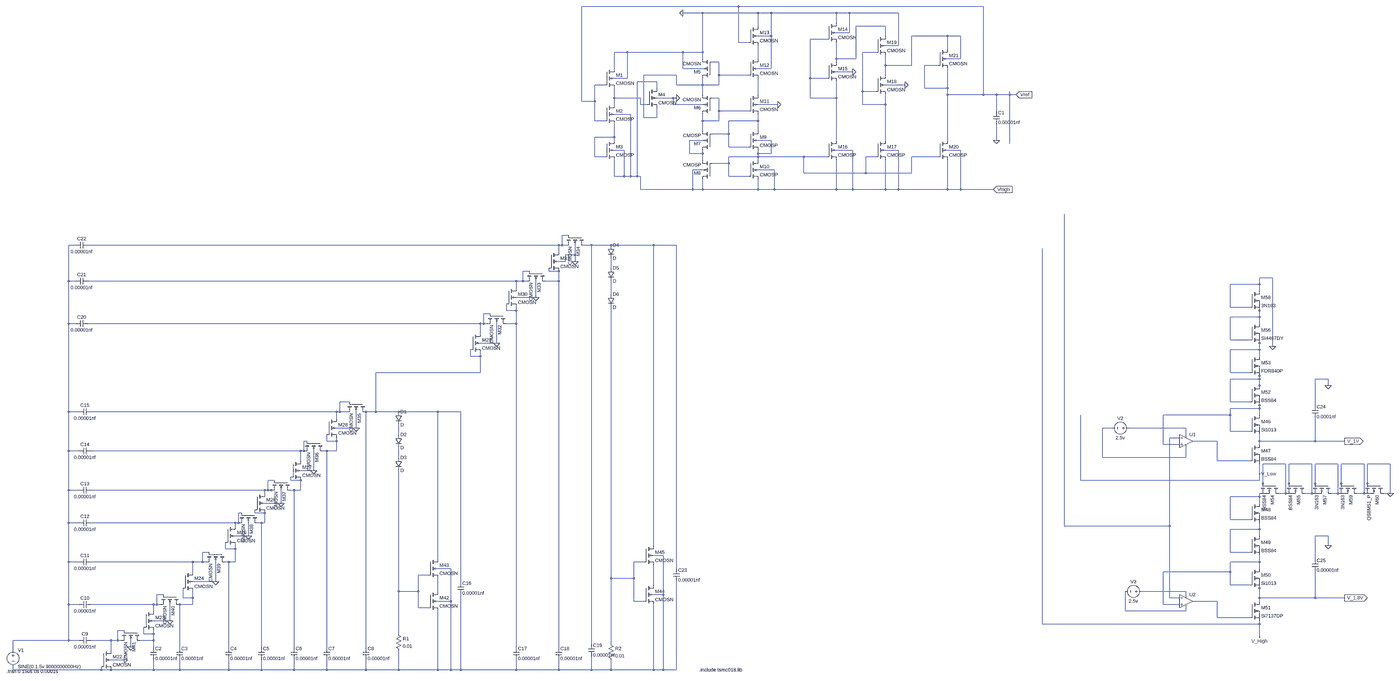
[diagram p0: schematic Vreference_regulator_rectifier.asc, whole sheet]
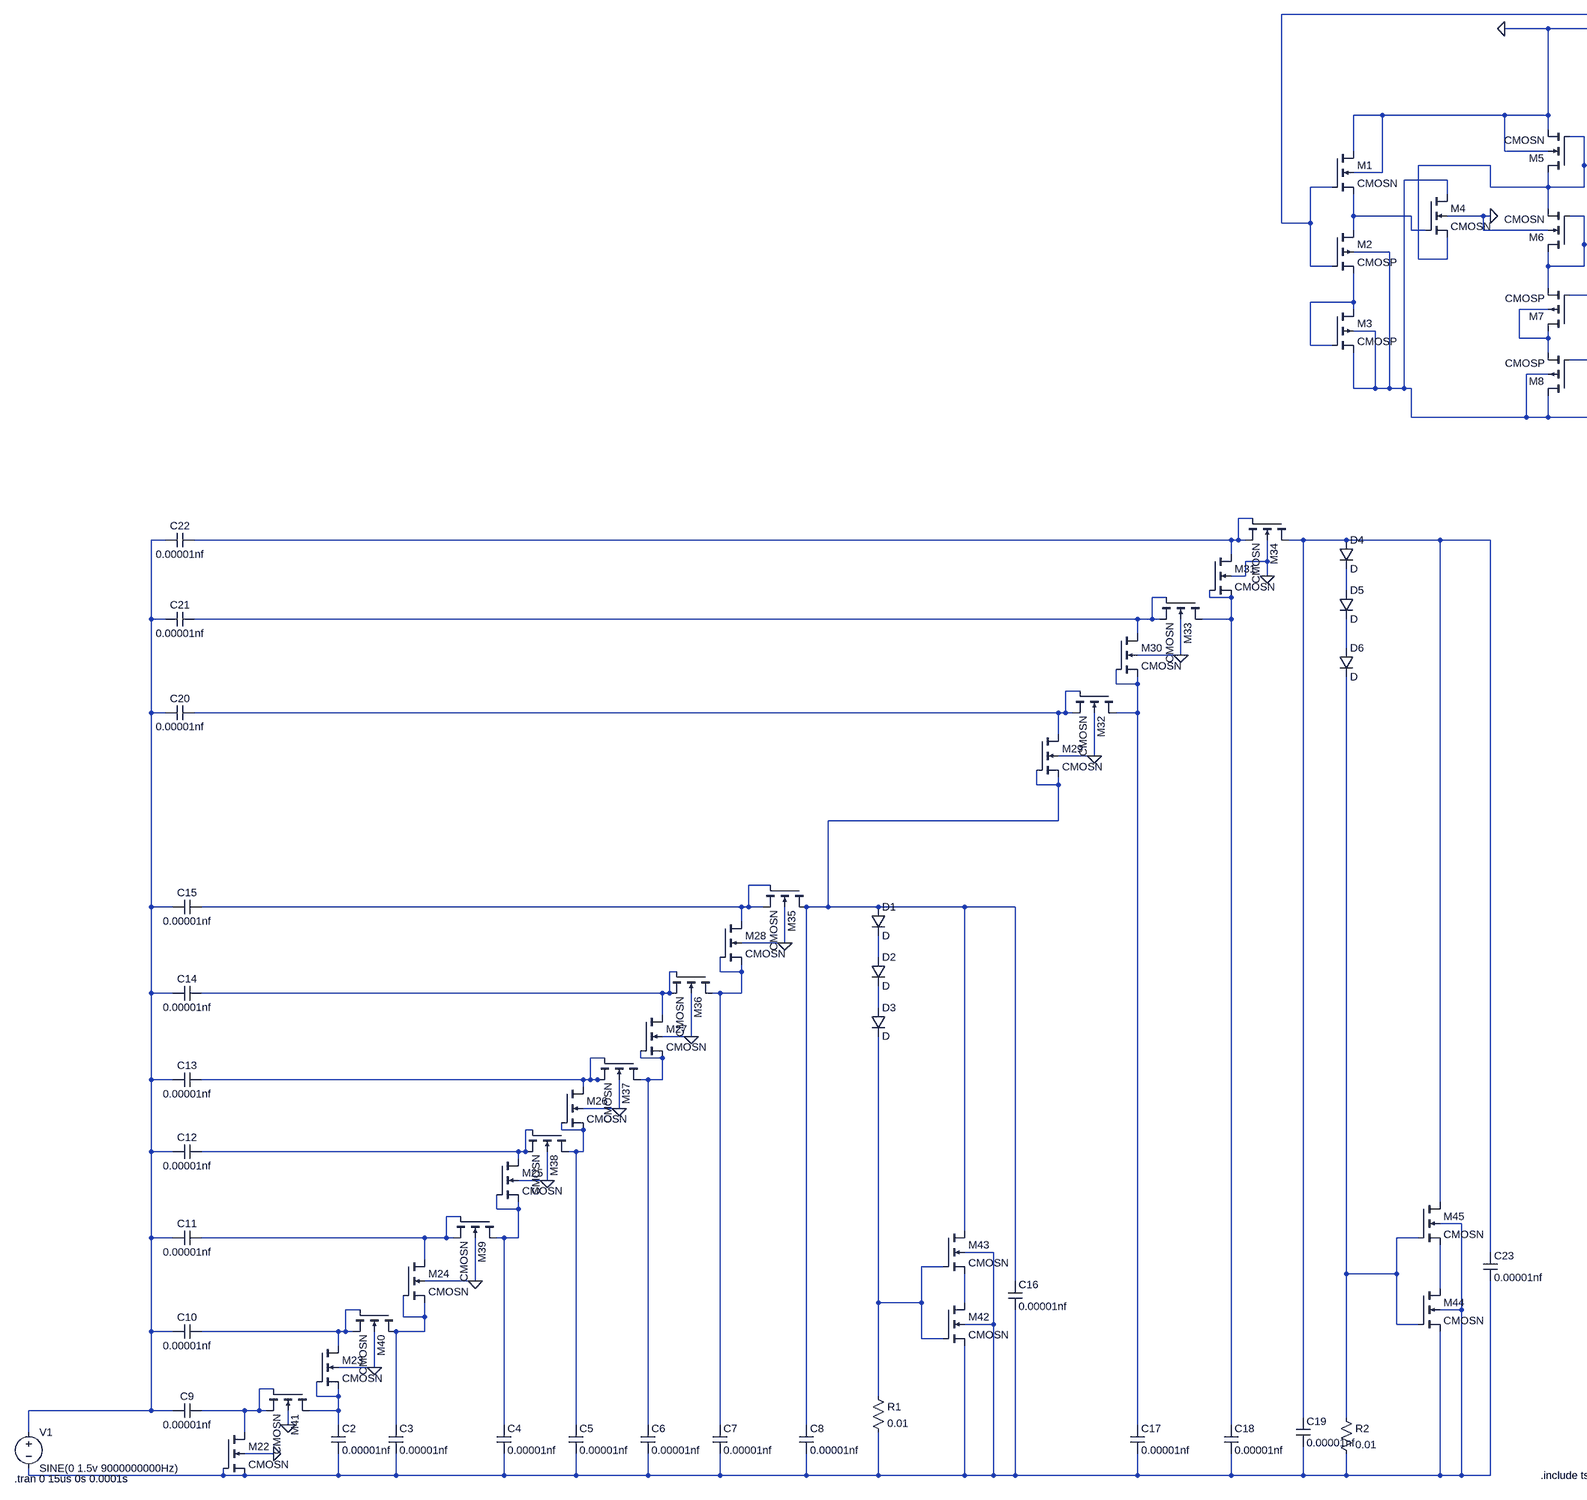
[diagram p1: schematic Vreference_regulator_rectifier.asc, part, row 1 of 1, column 1 of 2]
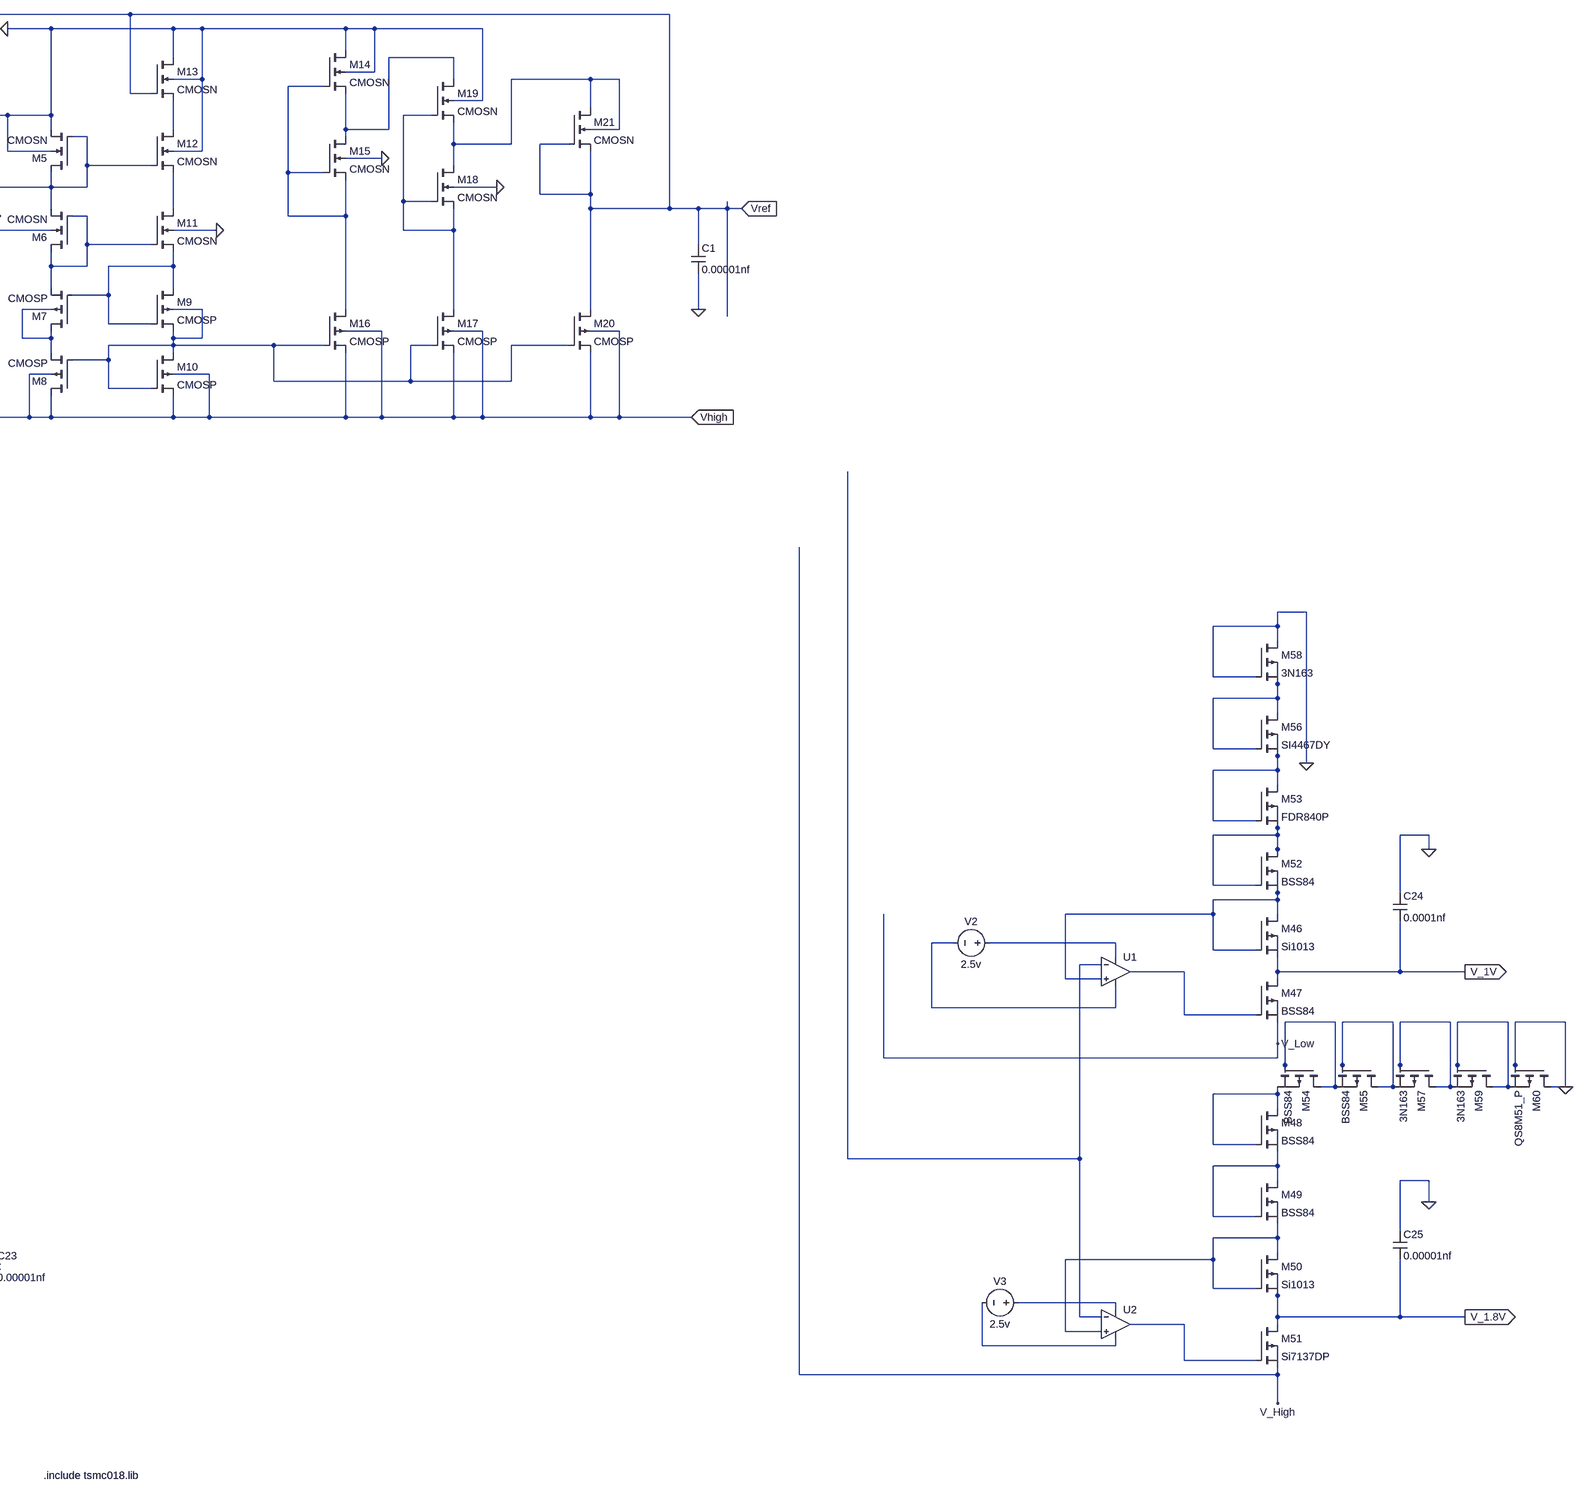
[diagram p2: schematic Vreference_regulator_rectifier.asc, part, row 1 of 1, column 2 of 2]
Vreference_regulator_rectifier.asc, the LTspice schematic file:
Version 4
SHEET 1 4676 1368
WIRE -880 -5136 -1648 -5136
WIRE 336 -5136 -880 -5136
WIRE -1056 -5104 -1152 -5104
WIRE -784 -5104 -1056 -5104
WIRE -720 -5104 -784 -5104
WIRE -384 -5104 -720 -5104
WIRE -320 -5104 -384 -5104
WIRE -80 -5104 -320 -5104
WIRE -384 -5056 -384 -5104
WIRE -784 -5040 -784 -5104
WIRE -144 -5040 -288 -5040
WIRE -320 -5008 -320 -5104
WIRE -320 -5008 -384 -5008
WIRE -720 -4992 -720 -5104
WIRE -720 -4992 -784 -4992
WIRE -144 -4992 -144 -5040
WIRE 160 -4992 -16 -4992
WIRE 224 -4992 160 -4992
WIRE -432 -4976 -512 -4976
WIRE -880 -4960 -880 -5136
WIRE -832 -4960 -880 -4960
WIRE -80 -4944 -80 -5104
WIRE -80 -4944 -144 -4944
WIRE 160 -4928 160 -4992
WIRE -1424 -4912 -1488 -4912
WIRE -1152 -4912 -1424 -4912
WIRE -1056 -4912 -1056 -5104
WIRE -1056 -4912 -1152 -4912
WIRE -192 -4912 -256 -4912
WIRE -1056 -4880 -1056 -4912
WIRE -784 -4880 -784 -4944
WIRE -384 -4880 -384 -4960
WIRE -288 -4880 -288 -5040
WIRE -288 -4880 -384 -4880
WIRE 224 -4880 224 -4992
WIRE 224 -4880 160 -4880
WIRE -976 -4864 -1008 -4864
WIRE -384 -4864 -384 -4880
WIRE -144 -4848 -144 -4896
WIRE -16 -4848 -16 -4992
WIRE -16 -4848 -144 -4848
WIRE 112 -4848 48 -4848
WIRE -1488 -4832 -1488 -4912
WIRE -1152 -4832 -1152 -4912
WIRE -1056 -4832 -1152 -4832
WIRE -720 -4832 -720 -4992
WIRE -720 -4832 -784 -4832
WIRE -304 -4816 -384 -4816
WIRE -1184 -4800 -1344 -4800
WIRE -976 -4800 -976 -4864
WIRE -832 -4800 -976 -4800
WIRE -144 -4800 -144 -4848
WIRE -1424 -4784 -1424 -4912
WIRE -1424 -4784 -1488 -4784
WIRE -512 -4784 -512 -4976
WIRE -432 -4784 -512 -4784
WIRE -1280 -4768 -1376 -4768
WIRE -1536 -4752 -1584 -4752
WIRE -1184 -4752 -1184 -4800
WIRE -1056 -4752 -1056 -4784
WIRE -1056 -4752 -1184 -4752
WIRE -976 -4752 -976 -4800
WIRE -976 -4752 -1056 -4752
WIRE -48 -4752 -144 -4752
WIRE -1280 -4736 -1280 -4768
WIRE 48 -4736 48 -4848
WIRE 160 -4736 160 -4832
WIRE 160 -4736 48 -4736
WIRE -256 -4720 -256 -4912
WIRE -192 -4720 -256 -4720
WIRE -1056 -4704 -1056 -4752
WIRE -784 -4704 -784 -4784
WIRE 160 -4704 160 -4736
WIRE 336 -4704 336 -5136
WIRE 336 -4704 160 -4704
WIRE 400 -4704 336 -4704
WIRE 464 -4704 464 -4720
WIRE 464 -4704 400 -4704
WIRE 496 -4704 464 -4704
WIRE -1488 -4688 -1488 -4736
WIRE -1360 -4688 -1488 -4688
WIRE -1200 -4688 -1280 -4688
WIRE -1184 -4688 -1200 -4688
WIRE -976 -4688 -1008 -4688
WIRE -512 -4688 -512 -4784
WIRE -384 -4688 -384 -4768
WIRE -384 -4688 -512 -4688
WIRE -1648 -4672 -1648 -5136
WIRE -1584 -4672 -1584 -4752
WIRE -1584 -4672 -1648 -4672
WIRE -1488 -4656 -1488 -4688
WIRE -1360 -4656 -1360 -4688
WIRE -1328 -4656 -1360 -4656
WIRE -1200 -4656 -1200 -4688
WIRE -1056 -4656 -1200 -4656
WIRE -688 -4656 -784 -4656
WIRE -256 -4656 -256 -4720
WIRE -144 -4656 -144 -4704
WIRE -144 -4656 -256 -4656
WIRE -976 -4624 -976 -4688
WIRE -832 -4624 -976 -4624
WIRE 400 -4624 400 -4704
WIRE -1408 -4608 -1488 -4608
WIRE -1344 -4592 -1344 -4800
WIRE -1280 -4592 -1280 -4640
WIRE -1280 -4592 -1344 -4592
WIRE -1584 -4576 -1584 -4672
WIRE -1536 -4576 -1584 -4576
WIRE -1056 -4576 -1056 -4608
WIRE -976 -4576 -976 -4624
WIRE -976 -4576 -1056 -4576
WIRE -784 -4576 -784 -4608
WIRE -784 -4576 -928 -4576
WIRE -1056 -4528 -1056 -4576
WIRE -784 -4528 -784 -4576
WIRE -928 -4512 -928 -4576
WIRE -928 -4512 -1008 -4512
WIRE -1488 -4496 -1488 -4560
WIRE -1488 -4496 -1584 -4496
WIRE -1488 -4480 -1488 -4496
WIRE -1056 -4480 -1120 -4480
WIRE -720 -4480 -784 -4480
WIRE -384 -4480 -384 -4688
WIRE -144 -4480 -144 -4656
WIRE 160 -4480 160 -4704
WIRE 400 -4480 400 -4560
WIRE 464 -4464 464 -4704
WIRE -928 -4448 -928 -4512
WIRE -832 -4448 -928 -4448
WIRE -1440 -4432 -1488 -4432
WIRE -304 -4432 -384 -4432
WIRE -80 -4432 -144 -4432
WIRE 224 -4432 160 -4432
WIRE -1120 -4416 -1120 -4480
WIRE -1056 -4416 -1056 -4432
WIRE -1056 -4416 -1120 -4416
WIRE -784 -4416 -784 -4432
WIRE -720 -4416 -720 -4480
WIRE -720 -4416 -784 -4416
WIRE -1584 -4400 -1584 -4496
WIRE -1536 -4400 -1584 -4400
WIRE -784 -4400 -784 -4416
WIRE -784 -4400 -928 -4400
WIRE -544 -4400 -784 -4400
WIRE -432 -4400 -544 -4400
WIRE -192 -4400 -240 -4400
WIRE 112 -4400 -16 -4400
WIRE -1056 -4384 -1056 -4416
WIRE -784 -4384 -784 -4400
WIRE -928 -4368 -928 -4400
WIRE -928 -4368 -1008 -4368
WIRE -1056 -4336 -1104 -4336
WIRE -704 -4336 -784 -4336
WIRE -544 -4320 -544 -4400
WIRE -240 -4320 -240 -4400
WIRE -240 -4320 -544 -4320
WIRE -16 -4320 -16 -4400
WIRE -16 -4320 -240 -4320
WIRE -1488 -4304 -1488 -4384
WIRE -1440 -4304 -1440 -4432
WIRE -1440 -4304 -1488 -4304
WIRE -1408 -4304 -1408 -4608
WIRE -1408 -4304 -1440 -4304
WIRE -1376 -4304 -1376 -4768
WIRE -1376 -4304 -1408 -4304
WIRE -1360 -4304 -1376 -4304
WIRE -928 -4304 -928 -4368
WIRE -832 -4304 -928 -4304
WIRE -1360 -4240 -1360 -4304
WIRE -1104 -4240 -1104 -4336
WIRE -1104 -4240 -1360 -4240
WIRE -1056 -4240 -1056 -4288
WIRE -1056 -4240 -1104 -4240
WIRE -784 -4240 -784 -4288
WIRE -784 -4240 -1056 -4240
WIRE -704 -4240 -704 -4336
WIRE -704 -4240 -784 -4240
WIRE -384 -4240 -384 -4384
WIRE -384 -4240 -704 -4240
WIRE -304 -4240 -304 -4432
WIRE -304 -4240 -384 -4240
WIRE -144 -4240 -144 -4384
WIRE -144 -4240 -304 -4240
WIRE -80 -4240 -80 -4432
WIRE -80 -4240 -144 -4240
WIRE 160 -4240 160 -4384
WIRE 160 -4240 -80 -4240
WIRE 224 -4240 224 -4432
WIRE 224 -4240 160 -4240
WIRE 384 -4240 224 -4240
WIRE -1712 -3120 -1744 -3120
WIRE -4128 -3072 -4160 -3072
WIRE -1760 -3072 -4064 -3072
WIRE -1744 -3072 -1744 -3120
WIRE -1744 -3072 -1760 -3072
WIRE -1728 -3072 -1744 -3072
WIRE -1600 -3072 -1632 -3072
WIRE -1504 -3072 -1600 -3072
WIRE -1296 -3072 -1504 -3072
WIRE -1184 -3072 -1296 -3072
WIRE -1760 -3040 -1760 -3072
WIRE -1680 -3024 -1680 -3072
WIRE -1680 -3024 -1728 -3024
WIRE -1728 -2992 -1728 -3024
WIRE -1728 -2992 -1760 -2992
WIRE -1680 -2992 -1680 -3024
WIRE -1504 -2960 -1504 -3008
WIRE -1904 -2944 -1936 -2944
WIRE -1808 -2944 -1808 -2960
WIRE -1760 -2944 -1808 -2944
WIRE 2112 -2912 2048 -2912
WIRE -4160 -2896 -4160 -3072
WIRE -4128 -2896 -4160 -2896
WIRE -1968 -2896 -4064 -2896
WIRE -1936 -2896 -1936 -2944
WIRE -1936 -2896 -1968 -2896
WIRE -1920 -2896 -1936 -2896
WIRE -1760 -2896 -1760 -2944
WIRE -1760 -2896 -1824 -2896
WIRE 2048 -2880 2048 -2912
WIRE 2048 -2880 1904 -2880
WIRE -1968 -2864 -1968 -2896
WIRE 2048 -2848 2048 -2880
WIRE -1504 -2832 -1504 -2896
WIRE -1872 -2816 -1872 -2896
WIRE -1872 -2816 -1968 -2816
WIRE 1904 -2768 1904 -2880
WIRE 2000 -2768 1904 -2768
WIRE -2016 -2752 -2016 -2784
WIRE -1968 -2752 -1968 -2768
WIRE -1968 -2752 -2016 -2752
WIRE 2048 -2752 2048 -2768
WIRE -2096 -2736 -2128 -2736
WIRE 2048 -2720 2048 -2752
WIRE 2048 -2720 1904 -2720
WIRE -4160 -2688 -4160 -2896
WIRE -4128 -2688 -4160 -2688
WIRE -2144 -2688 -4064 -2688
WIRE -2128 -2688 -2128 -2736
WIRE -2128 -2688 -2144 -2688
WIRE -2112 -2688 -2128 -2688
WIRE -1968 -2688 -1968 -2752
WIRE -1968 -2688 -2016 -2688
WIRE 2048 -2688 2048 -2720
WIRE -2144 -2640 -2144 -2688
WIRE 1904 -2608 1904 -2720
WIRE 2000 -2608 1904 -2608
WIRE -2064 -2592 -2064 -2688
WIRE -2064 -2592 -2144 -2592
WIRE 2048 -2592 2048 -2608
WIRE 2112 -2576 2112 -2912
WIRE 2048 -2560 2048 -2592
WIRE 2048 -2560 1904 -2560
WIRE -2192 -2528 -2192 -2560
WIRE -2144 -2528 -2144 -2544
WIRE -2144 -2528 -2192 -2528
WIRE 2048 -2528 2048 -2560
WIRE -2144 -2448 -2144 -2528
WIRE -2144 -2448 -2656 -2448
WIRE 1904 -2448 1904 -2560
WIRE 2000 -2448 1904 -2448
WIRE 2048 -2432 2048 -2448
WIRE 2048 -2416 2048 -2432
WIRE 2048 -2416 1904 -2416
WIRE 2384 -2416 2320 -2416
WIRE 2048 -2384 2048 -2416
WIRE 2384 -2384 2384 -2416
WIRE 2048 -2368 2048 -2384
WIRE -2784 -2304 -2832 -2304
WIRE 1904 -2304 1904 -2416
WIRE 2000 -2304 1904 -2304
WIRE 2048 -2288 2048 -2304
WIRE 2320 -2288 2320 -2416
WIRE 2048 -2272 2048 -2288
WIRE 2048 -2272 1904 -2272
WIRE -4160 -2256 -4160 -2688
WIRE -4112 -2256 -4160 -2256
WIRE -2848 -2256 -4048 -2256
WIRE -2832 -2256 -2832 -2304
WIRE -2832 -2256 -2848 -2256
WIRE -2800 -2256 -2832 -2256
WIRE -2656 -2256 -2656 -2448
WIRE -2656 -2256 -2704 -2256
WIRE -2544 -2256 -2656 -2256
WIRE -2352 -2256 -2544 -2256
WIRE -2240 -2256 -2352 -2256
WIRE 1904 -2240 1904 -2272
WIRE 1904 -2240 1536 -2240
WIRE 2048 -2240 2048 -2272
WIRE -2848 -2224 -2848 -2256
WIRE -2752 -2176 -2752 -2256
WIRE -2752 -2176 -2848 -2176
WIRE 1280 -2176 1232 -2176
WIRE 1648 -2176 1360 -2176
WIRE 1904 -2160 1904 -2240
WIRE 2000 -2160 1904 -2160
WIRE -2544 -2144 -2544 -2192
WIRE 1648 -2144 1648 -2176
WIRE 1616 -2128 1568 -2128
WIRE -2992 -2112 -3008 -2112
WIRE -2896 -2112 -2896 -2144
WIRE -2848 -2112 -2848 -2128
WIRE -2848 -2112 -2896 -2112
WIRE 1840 -2112 1680 -2112
WIRE 2048 -2112 2048 -2144
WIRE 2320 -2112 2320 -2224
WIRE 2320 -2112 2048 -2112
WIRE 2464 -2112 2320 -2112
WIRE 1536 -2096 1536 -2240
WIRE 1616 -2096 1536 -2096
WIRE 2048 -2096 2048 -2112
WIRE -4160 -2064 -4160 -2256
WIRE -4112 -2064 -4160 -2064
WIRE -3024 -2064 -4048 -2064
WIRE -3008 -2064 -3008 -2112
WIRE -3008 -2064 -3024 -2064
WIRE -2896 -2064 -2912 -2064
WIRE -2848 -2064 -2848 -2112
WIRE -2848 -2064 -2896 -2064
WIRE -2544 -2032 -2544 -2080
WIRE 1232 -2032 1232 -2176
WIRE 1648 -2032 1648 -2080
WIRE 1648 -2032 1232 -2032
WIRE -3024 -2016 -3024 -2064
WIRE 1840 -2016 1840 -2112
WIRE 2000 -2016 1840 -2016
WIRE 2176 -2000 2064 -2000
WIRE 2304 -2000 2192 -2000
WIRE 2432 -2000 2320 -2000
WIRE 2560 -2000 2448 -2000
WIRE 2688 -2000 2576 -2000
WIRE -2960 -1968 -2960 -2064
WIRE -2960 -1968 -3024 -1968
WIRE 2048 -1952 2048 -2000
WIRE -3152 -1920 -3184 -1920
WIRE -3072 -1920 -3072 -1936
WIRE -3024 -1920 -3072 -1920
WIRE 960 -1920 960 -2240
WIRE 2048 -1920 2048 -1952
WIRE 2048 -1920 960 -1920
WIRE 2064 -1904 2064 -2000
WIRE 2192 -1904 2192 -2000
WIRE 2320 -1904 2320 -2000
WIRE 2448 -1904 2448 -2000
WIRE 2576 -1904 2576 -2000
WIRE 2064 -1888 2064 -1904
WIRE 2192 -1888 2192 -1904
WIRE 2320 -1888 2320 -1904
WIRE 2448 -1888 2448 -1904
WIRE 2576 -1888 2576 -1904
WIRE -4160 -1872 -4160 -2064
WIRE -4112 -1872 -4160 -1872
WIRE -3200 -1872 -4048 -1872
WIRE -3184 -1872 -3184 -1920
WIRE -3184 -1872 -3200 -1872
WIRE -3168 -1872 -3184 -1872
WIRE -3152 -1872 -3168 -1872
WIRE -3056 -1872 -3072 -1872
WIRE -3024 -1872 -3024 -1920
WIRE -3024 -1872 -3056 -1872
WIRE -3200 -1856 -3200 -1872
WIRE 2176 -1856 2176 -2000
WIRE 2176 -1856 2144 -1856
WIRE 2304 -1856 2304 -2000
WIRE 2304 -1856 2272 -1856
WIRE 2432 -1856 2432 -2000
WIRE 2432 -1856 2400 -1856
WIRE 2560 -1856 2560 -2000
WIRE 2560 -1856 2528 -1856
WIRE 2688 -1856 2688 -2000
WIRE 2688 -1856 2656 -1856
WIRE 2048 -1840 2048 -1856
WIRE 2048 -1840 1904 -1840
WIRE -3120 -1808 -3120 -1872
WIRE -3120 -1808 -3200 -1808
WIRE 2048 -1808 2048 -1840
WIRE -3312 -1760 -3328 -1760
WIRE -3248 -1760 -3248 -1776
WIRE -3200 -1760 -3248 -1760
WIRE 1904 -1728 1904 -1840
WIRE 2000 -1728 1904 -1728
WIRE -4160 -1712 -4160 -1872
WIRE -4112 -1712 -4160 -1712
WIRE -3344 -1712 -4048 -1712
WIRE -3328 -1712 -3328 -1760
WIRE -3328 -1712 -3344 -1712
WIRE -3216 -1712 -3232 -1712
WIRE -3200 -1712 -3200 -1760
WIRE -3200 -1712 -3216 -1712
WIRE -3344 -1696 -3344 -1712
WIRE 880 -1696 880 -3488
WIRE 1568 -1696 1568 -2128
WIRE 1568 -1696 880 -1696
WIRE 2048 -1680 2048 -1712
WIRE 2048 -1680 1904 -1680
WIRE -3280 -1648 -3280 -1712
WIRE -3280 -1648 -3344 -1648
WIRE 2048 -1648 2048 -1680
WIRE 2384 -1648 2320 -1648
WIRE -1296 -1600 -1296 -3072
WIRE 2384 -1600 2384 -1648
WIRE -3392 -1584 -3392 -1616
WIRE -3344 -1584 -3344 -1600
WIRE -3344 -1584 -3392 -1584
WIRE -3472 -1568 -3504 -1568
WIRE 1904 -1568 1904 -1680
WIRE 2000 -1568 1904 -1568
WIRE -1248 -1552 -1296 -1552
WIRE -2352 -1536 -2352 -2256
WIRE 2320 -1536 2320 -1648
WIRE -4160 -1520 -4160 -1712
WIRE -4112 -1520 -4160 -1520
WIRE -3552 -1520 -4048 -1520
WIRE -3504 -1520 -3504 -1568
WIRE -3504 -1520 -3552 -1520
WIRE -3488 -1520 -3504 -1520
WIRE -3376 -1520 -3392 -1520
WIRE -3344 -1520 -3344 -1584
WIRE -3344 -1520 -3376 -1520
WIRE -1344 -1520 -1392 -1520
WIRE 2048 -1520 2048 -1552
WIRE 2048 -1520 1904 -1520
WIRE -2288 -1488 -2352 -1488
WIRE -1184 -1488 -1184 -3072
WIRE 2048 -1488 2048 -1520
WIRE -3552 -1472 -3552 -1520
WIRE 1904 -1472 1904 -1520
WIRE 1904 -1472 1536 -1472
WIRE -2400 -1456 -2448 -1456
WIRE -1504 -1440 -1504 -2768
WIRE -1392 -1440 -1392 -1520
WIRE -1392 -1440 -1504 -1440
WIRE -3440 -1424 -3440 -1520
WIRE -3440 -1424 -3552 -1424
WIRE -2240 -1424 -2240 -2256
WIRE -1296 -1408 -1296 -1504
WIRE 1904 -1408 1904 -1472
WIRE 2000 -1408 1904 -1408
WIRE 2048 -1392 2048 -1408
WIRE -2544 -1376 -2544 -1968
WIRE -2448 -1376 -2448 -1456
WIRE -2448 -1376 -2544 -1376
WIRE -2352 -1376 -2352 -1440
WIRE 1648 -1376 1424 -1376
WIRE -3696 -1360 -3728 -1360
WIRE -1248 -1360 -1248 -1552
WIRE -1248 -1360 -1296 -1360
WIRE 1648 -1360 1648 -1376
WIRE -3600 -1344 -3600 -1392
WIRE -3552 -1344 -3552 -1376
WIRE -3552 -1344 -3600 -1344
WIRE 1568 -1344 1568 -1696
WIRE 1616 -1344 1568 -1344
WIRE 2048 -1344 2048 -1392
WIRE 2320 -1344 2320 -1472
WIRE 2320 -1344 2048 -1344
WIRE 2464 -1344 2320 -1344
WIRE -2288 -1328 -2288 -1488
WIRE -2288 -1328 -2352 -1328
WIRE -1392 -1328 -1392 -1440
WIRE -1344 -1328 -1392 -1328
WIRE 1840 -1328 1680 -1328
WIRE 2048 -1328 2048 -1344
WIRE -4160 -1312 -4160 -1520
WIRE -4112 -1312 -4160 -1312
WIRE -3744 -1312 -4048 -1312
WIRE -3728 -1312 -3728 -1360
WIRE -3728 -1312 -3744 -1312
WIRE -3712 -1312 -3728 -1312
WIRE -3552 -1312 -3552 -1344
WIRE -3552 -1312 -3616 -1312
WIRE 1536 -1312 1536 -1472
WIRE 1616 -1312 1536 -1312
WIRE -2448 -1296 -2448 -1376
WIRE -2400 -1296 -2448 -1296
WIRE -3744 -1280 -3744 -1312
WIRE 1344 -1280 1344 -1376
WIRE 1648 -1280 1648 -1296
WIRE 1648 -1280 1344 -1280
WIRE 1840 -1248 1840 -1328
WIRE 2000 -1248 1840 -1248
WIRE -3664 -1232 -3664 -1312
WIRE -3664 -1232 -3744 -1232
WIRE 624 -1216 624 -3056
WIRE 2048 -1216 2048 -1232
WIRE 2048 -1216 624 -1216
WIRE -3888 -1184 -3920 -1184
WIRE -3792 -1168 -3792 -1200
WIRE -3744 -1168 -3744 -1184
WIRE -3744 -1168 -3792 -1168
WIRE -2544 -1168 -2544 -1376
WIRE 2048 -1152 2048 -1216
WIRE -4160 -1136 -4160 -1312
WIRE -4160 -1136 -4432 -1136
WIRE -4112 -1136 -4160 -1136
WIRE -3952 -1136 -4048 -1136
WIRE -3920 -1136 -3920 -1184
WIRE -3920 -1136 -3952 -1136
WIRE -3904 -1136 -3920 -1136
WIRE -3744 -1136 -3744 -1168
WIRE -3744 -1136 -3808 -1136
WIRE -1600 -1120 -1600 -3072
WIRE -1504 -1120 -1504 -1440
WIRE -3856 -1104 -3856 -1136
WIRE -3744 -1104 -3744 -1136
WIRE -3616 -1104 -3616 -1312
WIRE -3376 -1104 -3376 -1520
WIRE -3216 -1104 -3216 -1712
WIRE -3056 -1104 -3056 -1872
WIRE -2896 -1104 -2896 -2064
WIRE -2704 -1104 -2704 -2256
WIRE -1968 -1104 -1968 -2688
WIRE -1760 -1104 -1760 -2896
WIRE -4432 -1088 -4432 -1136
WIRE -3952 -1088 -3952 -1136
WIRE -3888 -1040 -3952 -1040
WIRE -4432 -992 -4432 -1008
WIRE -4000 -992 -4000 -1008
WIRE -4000 -992 -4432 -992
WIRE -3952 -992 -4000 -992
WIRE -3744 -992 -3744 -1040
WIRE -3744 -992 -3952 -992
WIRE -3616 -992 -3616 -1040
WIRE -3616 -992 -3744 -992
WIRE -3376 -992 -3376 -1040
WIRE -3376 -992 -3616 -992
WIRE -3216 -992 -3216 -1040
WIRE -3216 -992 -3376 -992
WIRE -3056 -992 -3056 -1040
WIRE -3056 -992 -3216 -992
WIRE -2896 -992 -2896 -1040
WIRE -2896 -992 -3056 -992
WIRE -2704 -992 -2704 -1040
WIRE -2704 -992 -2896 -992
WIRE -2544 -992 -2544 -1088
WIRE -2544 -992 -2704 -992
WIRE -2352 -992 -2352 -1280
WIRE -2352 -992 -2544 -992
WIRE -2288 -992 -2288 -1328
WIRE -2288 -992 -2352 -992
WIRE -2240 -992 -2240 -1360
WIRE -2240 -992 -2288 -992
WIRE -1968 -992 -1968 -1040
WIRE -1968 -992 -2240 -992
WIRE -1760 -992 -1760 -1040
WIRE -1760 -992 -1968 -992
WIRE -1600 -992 -1600 -1056
WIRE -1600 -992 -1760 -992
WIRE -1504 -992 -1504 -1040
WIRE -1504 -992 -1600 -992
WIRE -1296 -992 -1296 -1312
WIRE -1296 -992 -1504 -992
WIRE -1248 -992 -1248 -1360
WIRE -1248 -992 -1296 -992
WIRE -1184 -992 -1184 -1424
WIRE -1184 -992 -1248 -992
FLAG -1184 -4688 0
FLAG -1152 -5104 0
FLAG -688 -4656 0
FLAG -304 -4816 0
FLAG -48 -4752 0
FLAG 400 -4480 0
FLAG 496 -4704 Vref
IOPIN 496 -4704 In
FLAG 384 -4240 Vhigh
IOPIN 384 -4240 In
FLAG -3856 -1104 0
FLAG -3888 -1040 0
FLAG -2752 -2176 0
FLAG -2960 -1968 0
FLAG -3120 -1808 0
FLAG -3280 -1648 0
FLAG -3440 -1424 0
FLAG -3664 -1232 0
FLAG -1872 -2816 0
FLAG -2064 -2592 0
FLAG -1680 -2992 0
FLAG 2112 -2576 0
FLAG 2384 -2384 0
FLAG 2384 -1600 0
FLAG 2048 -1152 V_High
FLAG 2048 -1952 V_Low
FLAG 2464 -1344 V_1.8V
IOPIN 2464 -1344 Out
FLAG 2464 -2112 V_1V
IOPIN 2464 -2112 Out
FLAG 2688 -1856 0
SYMBOL pmos4 -1536 -4656 R0
SYMATTR InstName M2
SYMATTR Value CMOSP
SYMBOL nmos4 -1536 -4832 R0
SYMATTR InstName M1
SYMATTR Value CMOSN
SYMBOL pmos4 -1536 -4480 R0
SYMATTR InstName M3
SYMATTR Value CMOSP
SYMBOL nmos4 -1328 -4736 R0
SYMATTR InstName M4
SYMATTR Value CMOSN
SYMBOL nmos4 -1008 -4784 R180
SYMATTR InstName M5
SYMATTR Value CMOSN
SYMBOL nmos4 -1008 -4608 R180
SYMATTR InstName M6
SYMATTR Value CMOSN
SYMBOL pmos4 -1008 -4432 R180
SYMATTR InstName M7
SYMATTR Value CMOSP
SYMBOL pmos4 -1008 -4288 R180
SYMATTR InstName M8
SYMATTR Value CMOSP
SYMBOL pmos4 -832 -4528 R0
SYMATTR InstName M9
SYMATTR Value CMOSP
SYMBOL pmos4 -832 -4384 R0
SYMATTR InstName M10
SYMATTR Value CMOSP
SYMBOL nmos4 -832 -4704 R0
SYMATTR InstName M11
SYMATTR Value CMOSN
SYMBOL nmos4 -832 -4880 R0
SYMATTR InstName M12
SYMATTR Value CMOSN
SYMBOL nmos4 -832 -5040 R0
SYMATTR InstName M13
SYMATTR Value CMOSN
SYMBOL nmos4 -432 -5056 R0
SYMATTR InstName M14
SYMATTR Value CMOSN
SYMBOL nmos4 -432 -4864 R0
SYMATTR InstName M15
SYMATTR Value CMOSN
SYMBOL pmos4 -432 -4480 R0
SYMATTR InstName M16
SYMATTR Value CMOSP
SYMBOL pmos4 -192 -4480 R0
SYMATTR InstName M17
SYMATTR Value CMOSP
SYMBOL nmos4 -192 -4800 R0
SYMATTR InstName M18
SYMATTR Value CMOSN
SYMBOL nmos4 -192 -4992 R0
SYMATTR InstName M19
SYMATTR Value CMOSN
SYMBOL pmos4 112 -4480 R0
SYMATTR InstName M20
SYMATTR Value CMOSP
SYMBOL nmos4 112 -4928 R0
SYMATTR InstName M21
SYMATTR Value CMOSN
SYMBOL cap 384 -4624 R0
SYMATTR InstName C1
SYMATTR Value 0.00001nf
SYMBOL cap -3760 -1104 R0
SYMATTR InstName C2
SYMATTR Value 0.00001nf
SYMBOL cap -3632 -1104 R0
SYMATTR InstName C3
SYMATTR Value 0.00001nf
SYMBOL cap -3392 -1104 R0
SYMATTR InstName C4
SYMATTR Value 0.00001nf
SYMBOL cap -3232 -1104 R0
SYMATTR InstName C5
SYMATTR Value 0.00001nf
SYMBOL cap -3072 -1104 R0
SYMATTR InstName C6
SYMATTR Value 0.00001nf
SYMBOL cap -2912 -1104 R0
SYMATTR InstName C7
SYMATTR Value 0.00001nf
SYMBOL cap -2720 -1104 R0
SYMATTR InstName C8
SYMATTR Value 0.00001nf
SYMBOL cap -4048 -1152 R90
WINDOW 0 0 32 VBottom 2
WINDOW 3 32 32 VTop 2
SYMATTR InstName C9
SYMATTR Value 0.00001nf
SYMBOL cap -4048 -1328 R90
WINDOW 0 0 32 VBottom 2
WINDOW 3 32 32 VTop 2
SYMATTR InstName C10
SYMATTR Value 0.00001nf
SYMBOL cap -4048 -1536 R90
WINDOW 0 0 32 VBottom 2
WINDOW 3 32 32 VTop 2
SYMATTR InstName C11
SYMATTR Value 0.00001nf
SYMBOL cap -4048 -1728 R90
WINDOW 0 0 32 VBottom 2
WINDOW 3 32 32 VTop 2
SYMATTR InstName C12
SYMATTR Value 0.00001nf
SYMBOL cap -4048 -1888 R90
WINDOW 0 0 32 VBottom 2
WINDOW 3 32 32 VTop 2
SYMATTR InstName C13
SYMATTR Value 0.00001nf
SYMBOL cap -4048 -2080 R90
WINDOW 0 0 32 VBottom 2
WINDOW 3 32 32 VTop 2
SYMATTR InstName C14
SYMATTR Value 0.00001nf
SYMBOL cap -4048 -2272 R90
WINDOW 0 0 32 VBottom 2
WINDOW 3 32 32 VTop 2
SYMATTR InstName C15
SYMATTR Value 0.00001nf
SYMBOL diode -2560 -2256 R0
SYMATTR InstName D1
SYMBOL diode -2560 -2144 R0
SYMATTR InstName D2
SYMBOL diode -2560 -2032 R0
SYMATTR InstName D3
SYMBOL res -2560 -1184 R0
SYMATTR InstName R1
SYMATTR Value 0.01
SYMBOL cap -2256 -1424 R0
SYMATTR InstName C16
SYMATTR Value 0.00001nf
SYMBOL cap -1984 -1104 R0
SYMATTR InstName C17
SYMATTR Value 0.00001nf
SYMBOL cap -1776 -1104 R0
SYMATTR InstName C18
SYMATTR Value 0.00001nf
SYMBOL cap -1616 -1120 R0
SYMATTR InstName C19
SYMATTR Value 0.00001nf
SYMBOL cap -4064 -2704 R90
WINDOW 0 0 32 VBottom 2
WINDOW 3 32 32 VTop 2
SYMATTR InstName C20
SYMATTR Value 0.00001nf
SYMBOL cap -4064 -2912 R90
WINDOW 0 0 32 VBottom 2
WINDOW 3 32 32 VTop 2
SYMATTR InstName C21
SYMATTR Value 0.00001nf
SYMBOL cap -4064 -3088 R90
WINDOW 0 0 32 VBottom 2
WINDOW 3 32 32 VTop 2
SYMATTR InstName C22
SYMATTR Value 0.00001nf
SYMBOL diode -1520 -3072 R0
SYMATTR InstName D4
SYMBOL diode -1520 -2960 R0
SYMATTR InstName D5
SYMBOL diode -1520 -2832 R0
SYMATTR InstName D6
SYMBOL res -1520 -1136 R0
SYMATTR InstName R2
SYMATTR Value 0.01
SYMBOL cap -1200 -1488 R0
SYMATTR InstName C23
SYMATTR Value 0.00001nf
SYMBOL nmos4 -4000 -1088 R0
SYMATTR InstName M22
SYMATTR Value CMOSN
SYMATTR Value2 l=0.18u w=0.5u
SYMBOL nmos4 -3792 -1280 R0
SYMATTR InstName M23
SYMATTR Value CMOSN
SYMATTR Value2 l=0.18u w=0.5u
SYMBOL nmos4 -3600 -1472 R0
SYMATTR InstName M24
SYMATTR Value CMOSN
SYMATTR Value2 l=0.18u w=0.5u
SYMBOL nmos4 -3392 -1696 R0
SYMATTR InstName M25
SYMATTR Value CMOSN
SYMATTR Value2 l=0.18u w=0.5u
SYMBOL nmos4 -3248 -1856 R0
SYMATTR InstName M26
SYMATTR Value CMOSN
SYMATTR Value2 l=0.18u w=0.5u
SYMBOL nmos4 -3072 -2016 R0
SYMATTR InstName M27
SYMATTR Value CMOSN
SYMATTR Value2 l=0.18u w=0.5u
SYMBOL nmos4 -2896 -2224 R0
SYMATTR InstName M28
SYMATTR Value CMOSN
SYMATTR Value2 l=0.18u w=0.5u
SYMBOL nmos4 -2192 -2640 R0
SYMATTR InstName M29
SYMATTR Value CMOSN
SYMATTR Value2 l=0.18u w=0.5u
SYMBOL nmos4 -2016 -2864 R0
SYMATTR InstName M30
SYMATTR Value CMOSN
SYMATTR Value2 l=0.18u w=0.5u
SYMBOL nmos4 -1808 -3040 R0
SYMATTR InstName M31
SYMATTR Value CMOSN
SYMATTR Value2 l=0.18u w=0.5u
SYMBOL nmos4 -2016 -2736 R90
SYMATTR InstName M32
SYMATTR Value CMOSN
SYMATTR Value2 l=0.18u w=0.5u
SYMBOL nmos4 -1824 -2944 R90
SYMATTR InstName M33
SYMATTR Value CMOSN
SYMATTR Value2 l=0.18u w=0.5u
SYMBOL nmos4 -1632 -3120 R90
SYMATTR InstName M34
SYMATTR Value CMOSN
SYMATTR Value2 l=0.18u w=0.5u
SYMBOL nmos4 -2704 -2304 R90
SYMATTR InstName M35
SYMATTR Value CMOSN
SYMATTR Value2 l=0.18u w=0.5u
SYMBOL nmos4 -2912 -2112 R90
SYMATTR InstName M36
SYMATTR Value CMOSN
SYMATTR Value2 l=0.18u w=0.5u
SYMBOL nmos4 -3072 -1920 R90
SYMATTR InstName M37
SYMATTR Value CMOSN
SYMATTR Value2 l=0.18u w=0.5u
SYMBOL nmos4 -3232 -1760 R90
SYMATTR InstName M38
SYMATTR Value CMOSN
SYMATTR Value2 l=0.18u w=0.5u
SYMBOL nmos4 -3392 -1568 R90
SYMATTR InstName M39
SYMATTR Value CMOSN
SYMATTR Value2 l=0.18u w=0.5u
SYMBOL nmos4 -3616 -1360 R90
SYMATTR InstName M40
SYMATTR Value CMOSN
SYMATTR Value2 l=0.18u w=0.5u
SYMBOL nmos4 -3808 -1184 R90
SYMATTR InstName M41
SYMATTR Value CMOSN
SYMATTR Value2 l=0.18u w=0.5u
SYMBOL nmos4 -2400 -1376 R0
SYMATTR InstName M42
SYMATTR Value CMOSN
SYMATTR Value2 l=0.18u w=0.5u
SYMBOL nmos4 -2400 -1536 R0
SYMATTR InstName M43
SYMATTR Value CMOSN
SYMATTR Value2 l=0.18u w=0.5u
SYMBOL nmos4 -1344 -1408 R0
SYMATTR InstName M44
SYMATTR Value CMOSN
SYMATTR Value2 l=0.18u w=0.5u
SYMBOL nmos4 -1344 -1600 R0
SYMATTR InstName M45
SYMATTR Value CMOSN
SYMATTR Value2 l=0.18u w=0.5u
SYMBOL voltage -4432 -1104 R0
WINDOW 123 0 0 Left 0
WINDOW 39 0 0 Left 0
SYMATTR InstName V1
SYMATTR Value SINE(0 1.5v 9000000000Hz)
SYMBOL cap 2304 -2288 R0
SYMATTR InstName C24
SYMATTR Value 0.0001nf
SYMBOL cap 2304 -1536 R0
SYMATTR InstName C25
SYMATTR Value 0.00001nf
SYMBOL voltage 1376 -2176 R90
WINDOW 0 -32 56 VBottom 2
WINDOW 3 32 56 VTop 2
WINDOW 123 0 0 Left 0
WINDOW 39 0 0 Left 0
SYMATTR InstName V2
SYMATTR Value 2.5v
SYMBOL voltage 1440 -1376 R90
WINDOW 0 -32 56 VBottom 2
WINDOW 3 32 56 VTop 2
WINDOW 123 0 0 Left 0
WINDOW 39 0 0 Left 0
SYMATTR InstName V3
SYMATTR Value 2.5v
SYMBOL pmos 2000 -2240 R0
SYMATTR InstName M46
SYMATTR Value Si1013
SYMBOL pmos 2000 -2096 R0
SYMATTR InstName M47
SYMATTR Value BSS84
SYMBOL pmos 2000 -1808 R0
SYMATTR InstName M48
SYMATTR Value BSS84
SYMBOL pmos 2000 -1648 R0
SYMATTR InstName M49
SYMATTR Value BSS84
SYMBOL pmos 2000 -1488 R0
SYMATTR InstName M50
SYMATTR Value Si1013
SYMBOL pmos 2000 -1328 R0
SYMATTR InstName M51
SYMATTR Value Si7137DP
SYMBOL pmos 2000 -2384 R0
SYMATTR InstName M52
SYMATTR Value BSS84
SYMBOL pmos 2000 -2528 R0
SYMATTR InstName M53
SYMATTR Value FDR840P
SYMBOL pmos 2144 -1904 R90
SYMATTR InstName M54
SYMATTR Value BSS84
SYMBOL Opamps\\UniversalOpamp2 1648 -2112 R0
SYMATTR InstName U1
SYMBOL Opamps\\UniversalOpamp2 1648 -1328 R0
SYMATTR InstName U2
SYMBOL pmos 2272 -1904 R90
SYMATTR InstName M55
SYMATTR Value BSS84
SYMBOL pmos 2000 -2688 R0
SYMATTR InstName M56
SYMATTR Value SI4467DY
SYMBOL pmos 2400 -1904 R90
SYMATTR InstName M57
SYMATTR Value 3N163
SYMBOL pmos 2000 -2848 R0
SYMATTR InstName M58
SYMATTR Value 3N163
SYMBOL pmos 2528 -1904 R90
SYMATTR InstName M59
SYMATTR Value 3N163
SYMBOL pmos 2656 -1904 R90
SYMATTR InstName M60
SYMATTR Value QS8M51_P
TEXT -4464 -984 Left 2 !.tran 0 15us 0s 0.0001s
TEXT -1072 -992 Left 2 !.include tsmc018.lib

The netlist it stands for:
* Vreference_regulator_rectifier.asc
M2 N008 Vref N011 Vhigh CMOSP
M1 0 Vref N008 0 CMOSN
M3 N011 N011 Vhigh Vhigh CMOSP
M4 Vhigh N008 N006 0 CMOSN
M5 N006 N006 0 0 CMOSN
M6 N009 N009 N006 0 CMOSN
M7 N012 N010 N009 N012 CMOSP
M8 Vhigh N013 N012 Vhigh CMOSP
M9 N010 N010 N013 N013 CMOSP
M10 N013 N013 Vhigh Vhigh CMOSP
M11 N007 N009 N010 0 CMOSN
M12 N005 N006 N007 0 CMOSN
M13 0 Vref N005 0 CMOSN
M14 0 N003 N001 0 CMOSN
M15 N001 N003 N003 0 CMOSN
M16 N003 N013 Vhigh Vhigh CMOSP
M17 N004 N013 Vhigh Vhigh CMOSP
M18 N002 N004 N004 0 CMOSN
M19 N001 N004 N002 0 CMOSN
M20 Vref N013 Vhigh Vhigh CMOSP
M21 N002 Vref Vref N002 CMOSN
C1 Vref 0 0.00001nf
C2 N061 N049 0.00001nf
C3 N057 N049 0.00001nf
C4 N047 N049 0.00001nf
C5 N045 N049 0.00001nf
C6 N042 N049 0.00001nf
C7 N034 N049 0.00001nf
C8 N025 N049 0.00001nf
C9 N060 N015 0.00001nf
C10 N056 N015 0.00001nf
C11 N048 N015 0.00001nf
C12 N044 N015 0.00001nf
C13 N041 N015 0.00001nf
C14 N033 N015 0.00001nf
C15 N027 N015 0.00001nf
D1 N025 N031 D
D2 N031 N036 D
D3 N036 N052 D
R1 N052 N049 0.01
C16 N025 N049 0.00001nf
C17 N021 N049 0.00001nf
C18 N019 N049 0.00001nf
C19 N016 N049 0.00001nf
C20 N023 N015 0.00001nf
C21 N018 N015 0.00001nf
C22 N014 N015 0.00001nf
D4 N016 N017 D
D5 N017 N020 D
D6 N020 N050 D
R2 N050 N049 0.01
C23 N016 N049 0.00001nf
M22 N060 N049 N049 0 CMOSN l=0.18u w=0.5u
M23 N056 N061 N061 0 CMOSN l=0.18u w=0.5u
M24 N048 N057 N057 0 CMOSN l=0.18u w=0.5u
M25 N044 N047 N047 0 CMOSN l=0.18u w=0.5u
M26 N041 N045 N045 0 CMOSN l=0.18u w=0.5u
M27 N033 N042 N042 0 CMOSN l=0.18u w=0.5u
M28 N027 N034 N034 0 CMOSN l=0.18u w=0.5u
M29 N023 N025 N025 0 CMOSN l=0.18u w=0.5u
M30 N018 N021 N021 0 CMOSN l=0.18u w=0.5u
M31 N014 N019 N019 0 CMOSN l=0.18u w=0.5u
M32 N021 N023 N023 0 CMOSN l=0.18u w=0.5u
M33 N019 N018 N018 0 CMOSN l=0.18u w=0.5u
M34 N016 N014 N014 0 CMOSN l=0.18u w=0.5u
M35 N025 N027 N027 0 CMOSN l=0.18u w=0.5u
M36 N034 N033 N033 0 CMOSN l=0.18u w=0.5u
M37 N042 N041 N041 0 CMOSN l=0.18u w=0.5u
M38 N045 N044 N044 0 CMOSN l=0.18u w=0.5u
M39 N047 N048 N048 0 CMOSN l=0.18u w=0.5u
M40 N057 N056 N056 0 CMOSN l=0.18u w=0.5u
M41 N061 N060 N060 0 CMOSN l=0.18u w=0.5u
M42 N054 N052 N049 N049 CMOSN l=0.18u w=0.5u
M43 N025 N052 N054 N049 CMOSN l=0.18u w=0.5u
M44 N053 N050 N049 N049 CMOSN l=0.18u w=0.5u
M45 N016 N050 N053 N049 CMOSN l=0.18u w=0.5u
V1 N015 N049 SINE(0 1.5v 9000000000Hz)
C24 0 V_1V 0.0001nf
C25 0 V_1.8V 0.00001nf
V2 N030 N029 2.5v
V3 N055 N059 2.5v
M46 N028 N028 V_1V V_1V Si1013
M47 V_1V N035 V_Low V_Low BSS84
M48 N043 N043 N046 N046 BSS84
M49 N046 N046 N051 N051 BSS84
M50 N051 N051 V_1.8V V_1.8V Si1013
M51 V_1.8V N058 V_High V_High Si7137DP
M52 N026 N026 N028 N028 BSS84
M53 N024 N024 N026 N026 FDR840P
M54 N037 N037 N043 N043 BSS84
XU1 N028 N032 N030 N029 N035 level.2 Avol=1Meg GBW=10Meg Slew=10Meg ilimit=25m rail=0 Vos=0 phimargin=45 en=0 enk=0 in=0 ink=0 Rin=500Meg  ; pins IN+ IN- V+ V- OUT
XU2 N051 N032 N055 N059 N058 level.2 Avol=1Meg GBW=10Meg Slew=10Meg ilimit=25m rail=0 Vos=0 phimargin=45 en=0 enk=0 in=0 ink=0 Rin=500Meg  ; pins IN+ IN- V+ V- OUT
M55 N038 N038 N037 N037 BSS84
M56 N022 N022 N024 N024 SI4467DY
M57 N039 N039 N038 N038 3N163
M58 0 0 N022 N022 3N163
M59 N040 N040 N039 N039 3N163
M60 0 0 N040 N040 QS8M51_P
.model D D
.lib standard.dio
.model NMOS NMOS
.model PMOS PMOS
.lib standard.mos
.tran 0 15us 0s 0.0001s
.include tsmc018.lib
.lib UniversalOpamps2.sub
.backanno
.end